# Altium project PCB_Project.PrjPcb
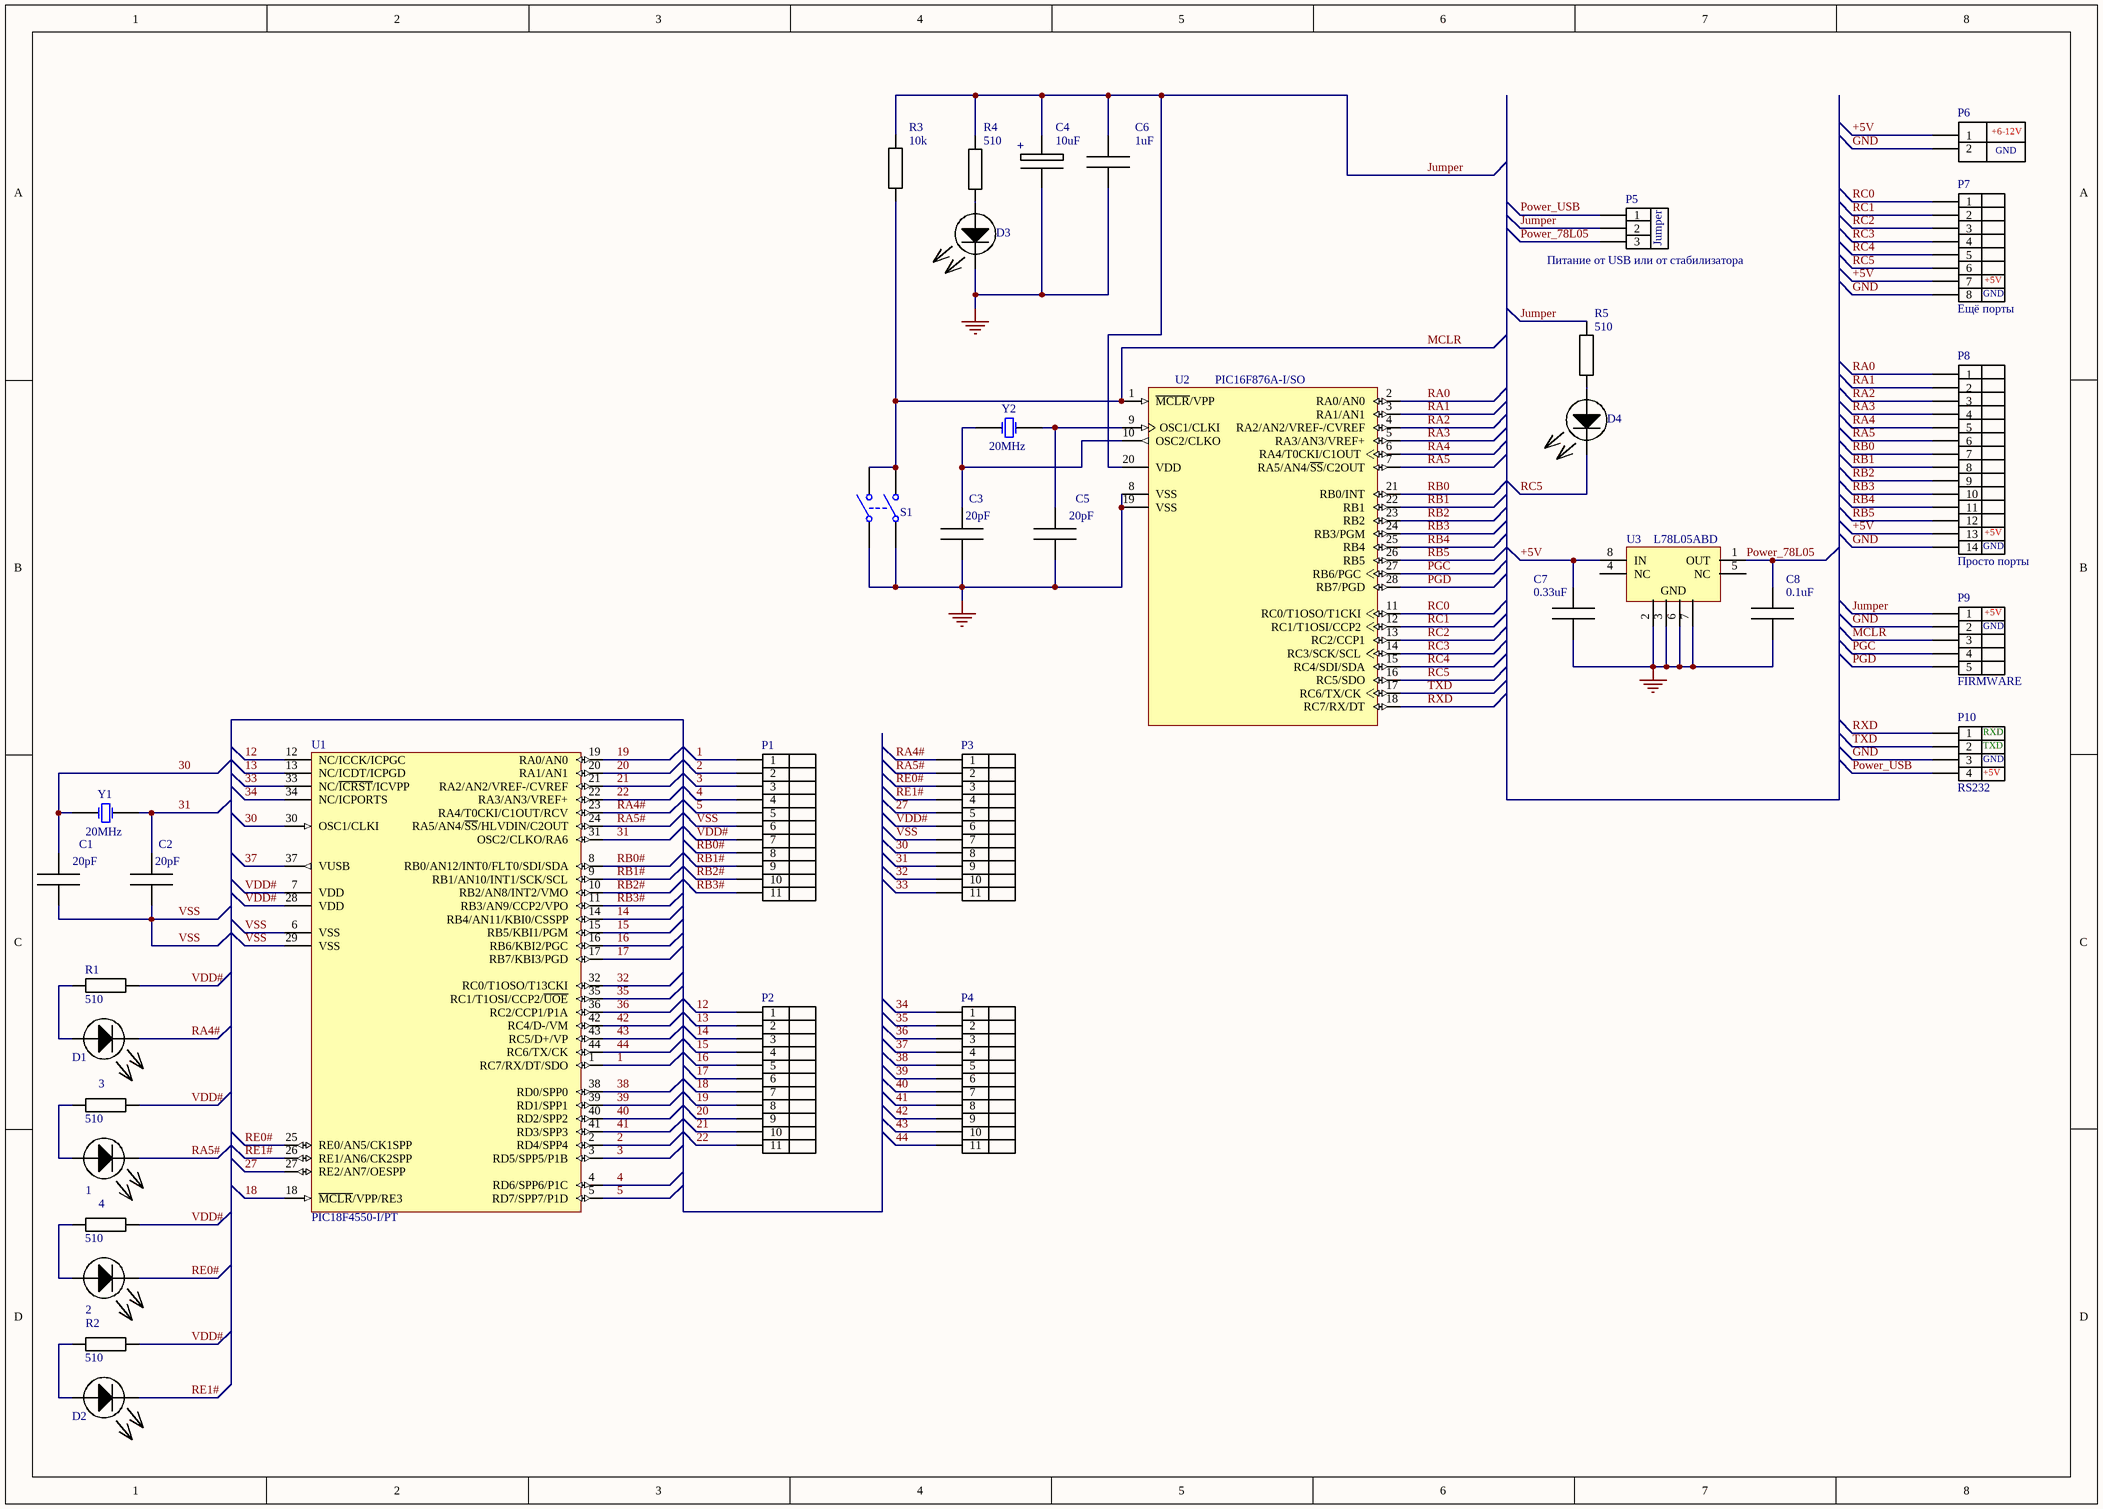
[diagram p0: Pic_Board.schdoc]
1 sheet, 37 parts. Net scope: global (net labels, ports and power ports of the same name join across sheets).
Board file: Pic_Board.PCBDOC

## Sheet Pic_Board.schdoc: AT long bus (13.3 x 4.2 inches)
size A3; Organization: Organization; Address1: Address1; Address2: Address2; Address3: Address3; Address4: Address4; DocumentNumber: 1; Revision: 0; SheetNumber: 2; SheetTotal: 2

### Parts
1  Diod  [C0805]  (value not drawn)
2  Diod  [C0805]  (value not drawn)
3  value 510  [6-0805_N]  (hidden comment: 0)
4  value 510  [6-0805_N]  (hidden comment: 0)
C1  value 20pF  [C0805]  (hidden comment: Cap_20pF)
C2  value 20pF  [C0805]  (hidden comment: Cap_20pF)
C3  value 20pF  [C0805]  (hidden comment: Cap_20pF)
C4  value 10uF  [2917(Taj-D)]  (hidden comment: Cap_10uF)
C5  value 20pF  [C0805]  (hidden comment: Cap_20pF)
C6  value 1uF  [1206]  (hidden comment: Cap_1uF)
C7  value 0.33uF  [1206]  (hidden comment: Cap_0.33uF)
C8  value 0.1uF  [C0805]  (hidden comment: Cap_0.1uF)
D1  Diod  [C0805]  (value not drawn)
D2  Diod  [C0805]  (value not drawn)
D3  Diod  [C0805]  (value not drawn)
D4  Diod  [C0805]  (value not drawn)
P1  Header 11  [HDR1X11]  (value not drawn)
P2  Header 11  [HDR1X11]  (value not drawn)
P3  Header 11  [HDR1X11]  (value not drawn)
P4  Header 11  [HDR1X11]  (value not drawn)
P5  Питание от USB или от стабилизатора  [HDR1X3]
P6  Power  [HDR1X2]  (value not drawn)
P7  Ещё порты  [HDR1X8]
P8  Просто порты  [HDR1X14]
P9  FIRMWARE  [HDR1X5H]
P10  RS232  [HDR1X4]
R1  value 510  [6-0805_N]  (hidden comment: 0)
R2  value 510  [6-0805_N]  (hidden comment: 0)
R3  10k  [6-0805_N]
R4  value 510  [6-0805_N]  (hidden comment: 0)
R5  value 510  [6-0805_N]  (hidden comment: 0)
S1  SW-DPST  [DPST-4]  (value not drawn)
U1  PIC18F4550-I/PT  [TQFP-PT44_N]
U2  PIC16F876A-I/SO  [SOIC-SO28_N]
U3  L78L05ABD  [SO8_N]
Y1  20MHz  [R38]
Y2  20MHz  [R38]

### Nets
GND: C3.2 C4.2 C5.2 C6.1 C7.2 C8.2 D3.2(K) P6.2 P7.8 P8.14 P9.2 P10.3 S1.1(COMMON1) S1.2(COMMON1) U2.8(VSS) U2.19(VSS) U3.2(GND) U3.3(GND) U3.6(GND) U3.7(GND)
1: P1.1 U1.1(RC7/RX/DT/SDO)
2: P1.2 U1.2(RD4/SPP4)
3: P1.3 U1.3(RD5/SPP5/P1B)
4: P1.4 U1.4(RD6/SPP6/P1C)
5: P1.5 U1.5(RD7/SPP7/P1D)
12: P2.1 U1.12(NC/ICCK/ICPGC)
13: P2.2 U1.13(NC/ICDT/ICPGD)
14: P2.3 U1.14(RB4/AN11/KBI0/CSSPP)
15: P2.4 U1.15(RB5/KBI1/PGM)
16: P2.5 U1.16(RB6/KBI2/PGC)
17: P2.6 U1.17(RB7/KBI3/PGD)
18: P2.7 U1.18(~{MCLR}/VPP/RE3)
19: P2.8 U1.19(RA0/AN0)
20: P2.9 U1.20(RA1/AN1)
21: P2.10 U1.21(RA2/AN2/VREF-/CVREF)
22: P2.11 U1.22(RA3/AN3/VREF+)
27: P3.5 U1.27(RE2/AN7/OESPP)
30: C1.1 P3.8 U1.30(OSC1/CLKI) Y1.1(OSC1)
31: C2.1 P3.9 U1.31(OSC2/CLKO/RA6) Y1.2(OSC2)
32: P3.10 U1.32(RC0/T1OSO/T13CKI)
33: P3.11 U1.33(NC/~{ICRST}/ICVPP)
34: P4.1 U1.34(NC/ICPORTS)
35: P4.2 U1.35(RC1/T1OSI/CCP2/~{UOE})
36: P4.3 U1.36(RC2/CCP1/P1A)
37: P4.4 U1.37(VUSB)
38: P4.5 U1.38(RD0/SPP0)
39: P4.6 U1.39(RD1/SPP1)
40: P4.7 U1.40(RD2/SPP2)
41: P4.8 U1.41(RD3/SPP3)
42: P4.9 U1.42(RC4/D-/VM)
43: P4.10 U1.43(RC5/D+/VP)
44: P4.11 U1.44(RC6/TX/CK)
+5V: C7.1 P6.1 P7.7 P8.13 U3.8(IN)
Jumper: C4.1 C6.2 P5.2 P9.1 R3.1 R4.1 R5.1 U2.20(VDD)
MCLR: P9.3 R3.2 S1.3(NO1) S1.4(NO1) U2.1(~{MCLR}/VPP)
PGC: P9.4 U2.27(RB6/PGC)
PGD: P9.5 U2.28(RB7/PGD)
Power_78L05: C8.1 P5.3 U3.1(OUT)
Power_USB: P5.1 P10.4
RA0: P8.1 U2.2(RA0/AN0)
RA1: P8.2 U2.3(RA1/AN1)
RA2: P8.3 U2.4(RA2/AN2/VREF-/CVREF)
RA3: P8.4 U2.5(RA3/AN3/VREF+)
RA4: P8.5 U2.6(RA4/T0CKI/C1OUT)
RA4#: D1.2(K) P3.1 U1.23(RA4/T0CKI/C1OUT/RCV)
RA5: P8.6 U2.7(RA5/AN4/~{SS}/C2OUT)
RA5#: 1.2(K) P3.2 U1.24(RA5/AN4/~{SS}/HLVDIN/C2OUT)
RB0: P8.7 U2.21(RB0/INT)
RB0#: P1.8 U1.8(RB0/AN12/INT0/FLT0/SDI/SDA)
RB1: P8.8 U2.22(RB1)
RB1#: P1.9 U1.9(RB1/AN10/INT1/SCK/SCL)
RB2: P8.9 U2.23(RB2)
RB2#: P1.10 U1.10(RB2/AN8/INT2/VMO)
RB3: P8.10 U2.24(RB3/PGM)
RB3#: P1.11 U1.11(RB3/AN9/CCP2/VPO)
RB4: P8.11 U2.25(RB4)
RB5: P8.12 U2.26(RB5)
RC0: P7.1 U2.11(RC0/T1OSO/T1CKI)
RC1: P7.2 U2.12(RC1/T1OSI/CCP2)
RC2: P7.3 U2.13(RC2/CCP1)
RC3: P7.4 U2.14(RC3/SCK/SCL)
RC4: P7.5 U2.15(RC4/SDI/SDA)
RC5: D4.2(K) P7.6 U2.16(RC5/SDO)
RE0#: 2.2(K) P3.3 U1.25(RE0/AN5/CK1SPP)
RE1#: D2.2(K) P3.4 U1.26(RE1/AN6/CK2SPP)
RXD: P10.1 U2.18(RC7/RX/DT)
TXD: P10.2 U2.17(RC6/TX/CK)
VDD#: 3.1 4.1 P1.7 P3.6 R1.1 R2.1 U1.7(VDD) U1.28(VDD)
VSS: C1.2 C2.2 P1.6 P3.7 U1.6(VSS) U1.29(VSS)
Net1_1: 1.1(A) 3.2
Net2_1: 2.1(A) 4.2
NetC3_1: C3.1 U2.10(OSC2/CLKO) Y2.1(OSC1)
NetC5_1: C5.1 U2.9(OSC1/CLKI) Y2.2(OSC2)
NetD1_1: D1.1(A) R1.2
NetD2_1: D2.1(A) R2.2
NetD3_1: D3.1(A) R4.2
NetD4_1: D4.1(A) R5.2

Not connected (* = marked no-connect by the designer): U3 4(NC) 5(NC)

### Notes on the sheet
- (in symbol Cap_10uF) +
- (in symbol Header 2) +6-12V; GND
- (in symbol Header 3) Jumper
- (in symbol Header 4) RXD; TXD; GND; +5V
- (in symbol Header 5H) +5V; GND
- (in symbol Header 8) +5V; GND
- (in symbol Header 14) +5V; GND

### Library data of the parts
3 4 R1 R2 R4 R5 = Res_2: Published: 24-Mar-1999; LatestRevisionDate: 29-May-2009; LatestRevisionNote: IPC-7351 Footprint Added.; PackageVersion: Mar-2003; PackageReference: 6-0805; Publisher: Altium Limited; PackageDescription: Chip Resistor 0805 Case Size; Code_IPC: RESC2012
P1-P4 = Header 11: Header, 11-Pin; LatestRevisionDate: 17-Jul-2002; LatestRevisionNote: Re-released for DXP Platform.; Publisher: Altium Limited
P5 = Header 3: Header, 3-Pin; LatestRevisionDate: 17-Jul-2002; LatestRevisionNote: Re-released for DXP Platform.; Publisher: Altium Limited
P6 = Header 2: Header, 2-Pin; LatestRevisionDate: 17-Jul-2002; LatestRevisionNote: Re-released for DXP Platform.; Publisher: Altium Limited
P7 = Header 8: Header, 8-Pin; LatestRevisionDate: 17-Jul-2002; LatestRevisionNote: Re-released for DXP Platform.; Publisher: Altium Limited
P8 = Header 14: Header, 14-Pin; LatestRevisionDate: 17-Jul-2002; LatestRevisionNote: Re-released for DXP Platform.; Publisher: Altium Limited
P9 = Header 5H: Header, 5-Pin, Right Angle; LatestRevisionDate: 17-Jul-2002; LatestRevisionNote: Re-released for DXP Platform.; Publisher: Altium Limited
P10 = Header 4: Header, 4-Pin; LatestRevisionDate: 17-Jul-2002; LatestRevisionNote: Re-released for DXP Platform.; Publisher: Altium Limited
R3 = Res Thermal: Thermistor; Published: 24-Mar-1999; LatestRevisionDate: 29-May-2009; LatestRevisionNote: IPC-7351 Footprint Added.; PackageVersion: Mar-2003; PackageReference: 6-0805; Publisher: Altium Limited; PackageDescription: Chip Resistor 0805 Case Size; Code_IPC: RESC2012
S1 = SW-DPST: Double-Pole, Single-Throw Switch; Published: 24-Mar-1999; LatestRevisionDate: 17-Jul-2002; LatestRevisionNote: Re-released for DXP Platform.; PackageReference: DPST-4; Publisher: Altium Limited; PackageDescription: Switch; 4 Leads
U1 = PIC18F4550-I/PT: High Performance, Enhanced Flash, USB Microcontroller with nanoWatt Technology, 32K Flash, 44-Pin TQFP, Industrial Temperature Range; Published: 29-Jan-2009; LatestRevisionDate: 02-Dec-2009; LatestRevisionNote: Updated to datasheet revision E, Aug-2008; DatasheetVersion: revE, Aug-2008; PackageVersion: revBB, Aug-2009; PackageReference: TQFP-PT44; Publisher: Altium Limited; PackageDescription: 44-Lead Plastic Thin Quad Flatpack (PT) - 10x10x1mm Body, 2.00mm [TQFP]; Supplier 1: Digi-Key; Supplier Part Number 1: PIC18F4550-I/PT-ND; Supplier 2: Farnell; Supplier Part Number 2: 9321365; Supplier 3: Farnell; Supplier Part Number 3: 1528447; Code_JEDEC: MS-026; ComponentLink1Description: Datasheet; ComponentLink1URL: http://ww1.microchip.com/downloads/en/DeviceDoc/39632e.pdf; ComponentLink2Description: Packaging Specification; ComponentLink2URL: http://www.microchip.com/stellent/groups/techpub_sg/documents/packagingspec/en012702.pdf; ComponentLink3Description: Microchip.com Home; ComponentLink3URL: http://www.microchip.com/
U2 = PIC16F876A-I/SO: Enhanced FLASH Microcontroller, 8K (x14-Bit words) FLASH, 368 Bytes RAM, 28-Pin SOIC, Standard VDD Range, Industrial Temperature; ComponentAvailability: Unknown. Contact manufacturer to determine status.; Published: 11-Oct-2004; LatestRevisionDate: 29-Jan-2009; LatestRevisionNote: Sch. layout revised. 3D Model Removed.; DatasheetVersion: revB, Oct-2003; PackageVersion: revBB, Aug-2009; PackageReference: SOIC-SO28; Publisher: Altium Limited; PackageDescription: 28-Lead Plastic Small Outline (SO) - Wide 7.50mm Body [SOIC]; Supplier 1: Digi-Key; Supplier Part Number 1: PIC16F876A-I/SO-ND; Supplier 2: Farnell; Supplier Part Number 2: 9761306; Supplier 3: Farnell; Supplier Part Number 3: 1660040; Code_JEDEC: MS-013; ComponentLink1Description: Datasheet; ComponentLink1URL: http://ww1.microchip.com/downloads/en/DeviceDoc/39582b.pdf; ComponentLink2Description: Packaging Specification; ComponentLink2URL: http://www.microchip.com/stellent/groups/techpub_sg/documents/packagingspec/en012702.pdf; ComponentLink3Description: Microchip.com Home; ComponentLink3URL: http://www.microchip.com/
U3 = L78L05ABD: Positive Voltage Regulator; Published: 24-Aug-2001; LatestRevisionDate: 13-Apr-2006; LatestRevisionNote: IPC-7351 Footprint Added.; DatasheetVersion: Feb-1999; PackageVersion: Dec-2002; PackageReference: SO8; Publisher: Altium Limited; PackageDescription: 8-Pin Small Outline Integrated Circuit 1.27 mm Pitch; Code_JEDEC: MS-012-AA; Code_IPC: SOIC127P600-8; ComponentLink1Description: Manufacturer Link; ComponentLink1URL: http://www.st.com/
Y1 Y2 = XTAL: Crystal Oscillator; Published: 8-Jun-2000; LatestRevisionDate: 17-Jul-2002; LatestRevisionNote: Re-released for DXP Platform.; PackageReference: R38; Publisher: Altium Limited; PackageDescription: Crystal, Thru-Hole; 2 Leads; Body 3.1 x 8.2 mm (Dia.xH)
C1-C3 C5 = Cap_20pF: Published: 8-Jun-2000; LatestRevisionDate: 29-May-2009; LatestRevisionNote: IPC-7351 Footprint Added.; PackageReference: C0805; Publisher: Altium Limited; PackageDescription: Chip Capacitor
C4 = Cap_10uF: Published: 8-Jun-2000; LatestRevisionDate: 29-May-2009; LatestRevisionNote: IPC-7351 Footprint Added.; PackageReference: C0805; Publisher: Altium Limited; PackageDescription: Chip Capacitor
C6 = Cap_1uF: Published: 8-Jun-2000; LatestRevisionDate: 29-May-2009; LatestRevisionNote: IPC-7351 Footprint Added.; PackageReference: C0805; Publisher: Altium Limited; PackageDescription: Chip Capacitor
C7 = Cap_0.33uF: LatestRevisionDate: 29-May-2009; LatestRevisionNote: IPC-7351 Footprint Added.; Publisher: Altium Limited; Published: 8-Jun-2000; PackageReference: C0805; PackageDescription: Chip Capacitor
C8 = Cap_0.1uF: LatestRevisionDate: 29-May-2009; LatestRevisionNote: IPC-7351 Footprint Added.; Publisher: Altium Limited; Published: 8-Jun-2000; PackageReference: C0805; PackageDescription: Chip Capacitor